# EAGLE design training_board (EAGLE 9.6.2)
AUTHOR: Varun Madabushi; REVISION: 0.1; SCH_DESC: Arduino Motor Shield for 2019-20 Training; TEAM: Electrical Training
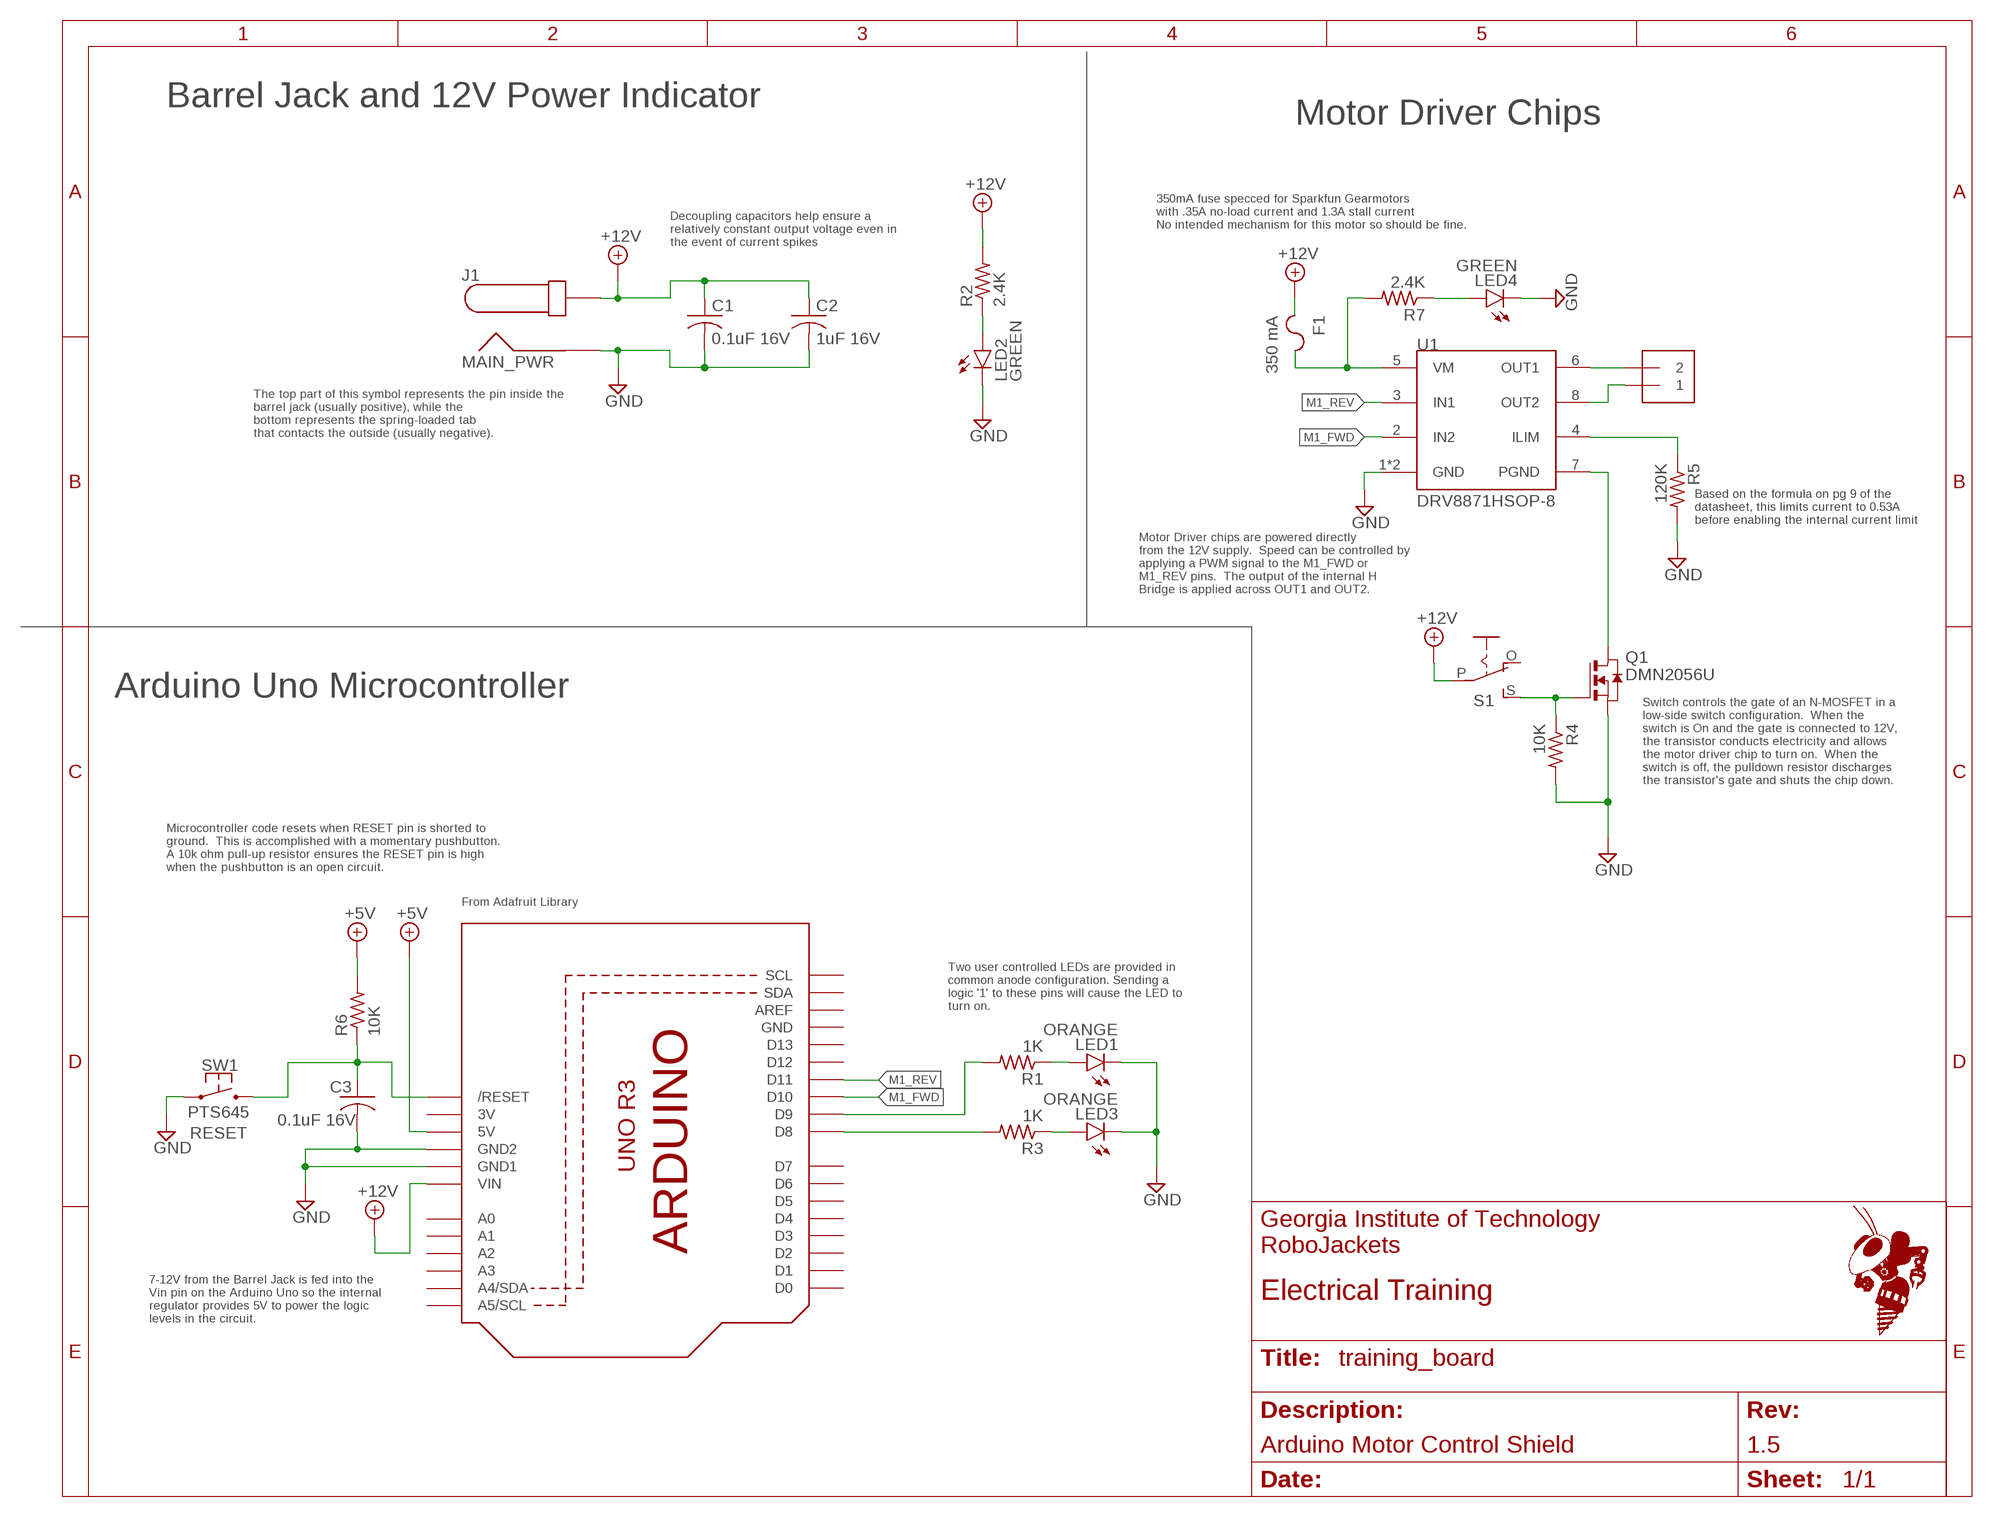
[diagram p0: schematic, sheet 1]
FRAME1 (FRAME_A_L): AUTHOR: Varun Madabushi; REVISION: 1.5; SCH_DESC: Arduino Motor Control Shield; TEAM: Electrical Training

## Parts
C1  0.1uF 16V  C-USC0805  [C0805]
C2  1uF 16V  C-USC0805  [C0805]
C3  0.1uF 16V  C-USC0805  [C0805]
F1  350 mA  CHIP_FUSE1812  [F1812]
J1  MAIN_PWR  PJ-037A  [PJ-037A]
LED1  ORANGE  LEDCHIP-LED0603  [CHIP-LED0603]
LED2  GREEN  LEDCHIP-LED0603  [CHIP-LED0603]
LED3  ORANGE  LEDCHIP-LED0603  [CHIP-LED0603]
LED4  GREEN  LEDCHIP-LED0603  [CHIP-LED0603]
OUT  1X2-3.5MM  [1X2-3.5MM]
Q1  DMN2056U  NMOSSOT-23-3  [SOT-23-3]
Q2  ARDUINOR3-NOIOREF-NOTEXT  [ARDUINOR3-NOTEXT-NOIOREF]
R1  1K  R-US_R0603  [R0603]
R2  2.4K  R-US_R0603  [R0603]
R3  1K  R-US_R0603  [R0603]
R4  10K  R-US_R0603  [R0603]
R5  120K  R-US_R0603  [R0603]
R6  10K  R-US_R0603  [R0603]
R7  2.4K  R-US_R0603  [R0603]
S1  EG1903-ND  EG1218S  [EG1218]
SW1  PTS645  [PTS645]
U1  DRV8871HSOP-8  [HSOP-8]

## Nets
+5V: Q2.5V R6.2
+12V: C1.1 C2.1 F1.1 J1.P$2 Q2.VIN R2.2 S1.P
GND: C1.2 C2.2 C3.2 J1.P$1 LED1.C LED2.C LED3.C LED4.C Q1.2(S) Q2.GND1 Q2.GND2 R4.2 R5.2 SW1.1 SW1.2 U1.1(GND) U1.9(GND)
M1_FWD: Q2.D10 U1.2(IN2)
M1_REV: Q2.D11 U1.3(IN1)
N$1: F1.2 R7.2 U1.5(VM)
N$2: OUT.2 U1.6(OUT1)
N$3: Q1.3(D) U1.7(PGND)
N$4: OUT.1 U1.8(OUT2)
N$5: Q1.1(G) R4.1 S1.S
N$6: R5.1 U1.4(ILIM)
N$8: LED4.A R7.1
N$10: Q2.D9 R1.2
N$11: Q2.D8 R3.2
N$14: LED1.A R1.1
N$15: LED3.A R3.1
N$16: LED2.A R2.1
RESET: C3.1 Q2.RESET(/RESET) R6.1 SW1.3 SW1.4
Unconnected: Q2.A0 Q2.A1 Q2.A2 Q2.A3 Q2.A4(A4/SDA) Q2.A5(A5/SCL) Q2.AREF Q2.D0 Q2.D1 Q2.D2 Q2.D3 Q2.D4 Q2.D5 Q2.D6 Q2.D7 Q2.D12 Q2.D13 Q2.SCL Q2.SDA S1.O

## Notes on the sheet
- Barrel Jack and 12V Power Indicator
- Motor Driver Chips
- 350mA fuse specced for Sparkfun Gearmotors
  with .35A no-load current and 1.3A stall current
  No intended mechanism for this motor so should be fine.
- Decoupling capacitors help ensure a
  relatively constant output voltage even in
  the event of current spikes
- The top part of this symbol represents the pin inside the 
  barrel jack (usually positive), while the
  bottom represents the spring-loaded tab
  that contacts the outside (usually negative).
- Based on the formula on pg 9 of the 
  datasheet, this limits current to 0.53A
  before enabling the internal current limit
- Motor Driver chips are powered directly
  from the 12V supply.  Speed can be controlled by
  applying a PWM signal to the M1_FWD or
  M1_REV pins.  The output of the internal H
  Bridge is applied across OUT1 and OUT2.
- Arduino Uno Microcontroller
- Switch controls the gate of an N-MOSFET in a
  low-side switch configuration.  When the
  switch is On and the gate is connected to 12V,
  the transistor conducts electricity and allows
  the motor driver chip to turn on.  When the
  switch is off, the pulldown resistor discharges
  the transistor's gate and shuts the chip down.
- Microcontroller code resets when RESET pin is shorted to
  ground.  This is accomplished with a momentary pushbutton. 
  A 10k ohm pull-up resistor ensures the RESET pin is high
  when the pushbutton is an open circuit.
- From Adafruit Library
- Two user controlled LEDs are provided in 
  common anode configuration. Sending a 
  logic '1' to these pins will cause the LED to
  turn on.
- 7-12V from the Barrel Jack is fed into the
  Vin pin on the Arduino Uno so the internal
  regulator provides 5V to power the logic 
  levels in the circuit.

## Power pins joined to a net without a drawn wire
3V: Q2.3V
GND: Q2.GND

## Library data of the parts
C1-C3 = rcl:C-US: CAPACITOR, American symbol; SPICEPREFIX: C
F1 = RoboJackets-Fuses:CHIP_FUSE
J1 = RoboJackets-Connectors:PJ-037A
LED1-LED4 = led:LED: LED OSRAM: - CHIPLED LG R971, LG N971, LY N971, LG Q971, LY Q971, LO R971, LY R971 LH N974, LH R974 LS Q976, LO Q976, LY Q976 LO Q996 - Hyper CHIPLED LW Q18S LB Q993, LB Q99A, LB R99A - SideLED LS A670, LO A670, LY A670, LG A670, LP A670 LB A673, LV A673, LT A673, LW A673 LH A674 LY A675 LS A676, LA A676, LO A676, LY A676, LW A676 LS A679, LY A679, LG A679 - Hyper Micro SIDELED® LS Y876, LA Y876, LO Y876, LY Y876 LT Y87S - SmartLED LW L88C, LW L88S LB L89C, LB L89S, LG L890 LS L89K, LO L89K, LY L89K LS L896, LA L896, LO L896, LY L896 - TOPLED LS T670, LO T670, LY T670, LG T670, LP T670 LSG T670, LSP T670, LSY T670, LOP T670, LYG T670 LG T671, LOG T671, LSG T671 LB T673, LV T673, LT T673, LW T673 LH T674 LS T676, LA T676, LO T676, LY T676, LB T676, LH T676, LSB T676, LW T676 LB T67C, LV T67C, LT T67C, LS T67K, LO T67K, LY T67K, LW E67C LS E67B, LA E67B, LO E67B, LY E67B, LB E67C, LV E67C, LT E67C LW T67C LS T679, LY T679, LG T679 LS T770, LO T770, LY T770, LG T770, LP T770 LB T773, LV T773, LT T773, LW T773 LH T774 LS E675, LA E675, LY E675, LS T675 LS T776, LA T776, LO T776, LY T776, LB T776 LHGB T686 LT T68C, LB T68C - Hyper Mini TOPLED® LB M676 - Mini TOPLED Santana® LG M470 LS M47K, LO M47K, LY M47K Source: http://www.osram.convergy.de LUXEON: - LUMILED® LXK2-PW12-R00, LXK2-PW12-S00, LXK2-PW14-U00, LXK2-PW14-V00 LXK2-PM12-R00, LXK2-PM12-S00, LXK2-PM14-U00 LXK2-PE12-Q00, LXK2-PE12-R00, LXK2-PE12-S00, LXK2-PE14-T00, LXK2-PE14-U00 LXK2-PB12-K00, LXK2-PB12-L00, LXK2-PB12-M00, LXK2-PB14-N00, LXK2-PB14-P00, LXK2-PB14-Q00 LXK2-PR12-L00, LXK2-PR12-M00, LXK2-PR14-Q00, LXK2-PR14-R00 LXK2-PD12-Q00, LXK2-PD12-R00, LXK2-PD12-S00 LXK2-PH12-R00, LXK2-PH12-S00 LXK2-PL12-P00, LXK2-PL12-Q00, LXK2-PL12-R00 Source: www.luxeon.com KINGBRIGHT: KA-3528ASYC Source: www.kingbright.com
OUT = adafruit:1X2: 3.5mm Terminal block http://www.ladyada.net/library/pcb/eaglelibrary.html
Q1 = RoboJackets-Discrete:NMOS
Q2 = adafruit:ARDUINOR3-NOIOREF
R1-R7 = rcl:R-US_: RESISTOR, American symbol; SPICEPREFIX: R
S1 = adafruit:EG1218: SLIDING SWITCH 0.1" spacing through hole, vertical SPDT slide switch http://www.ladyada.net/library/pcb/eaglelibrary.html
SW1 = RoboJackets-Switches:PTS645; FUNCTION: RESET
U1 = RoboJackets-ICs:DRV8871: 3.6-A Brushed DC Motor Driver With Internal Current Sense and PWM Control; DKPN: 296-43024-1-ND

## Board
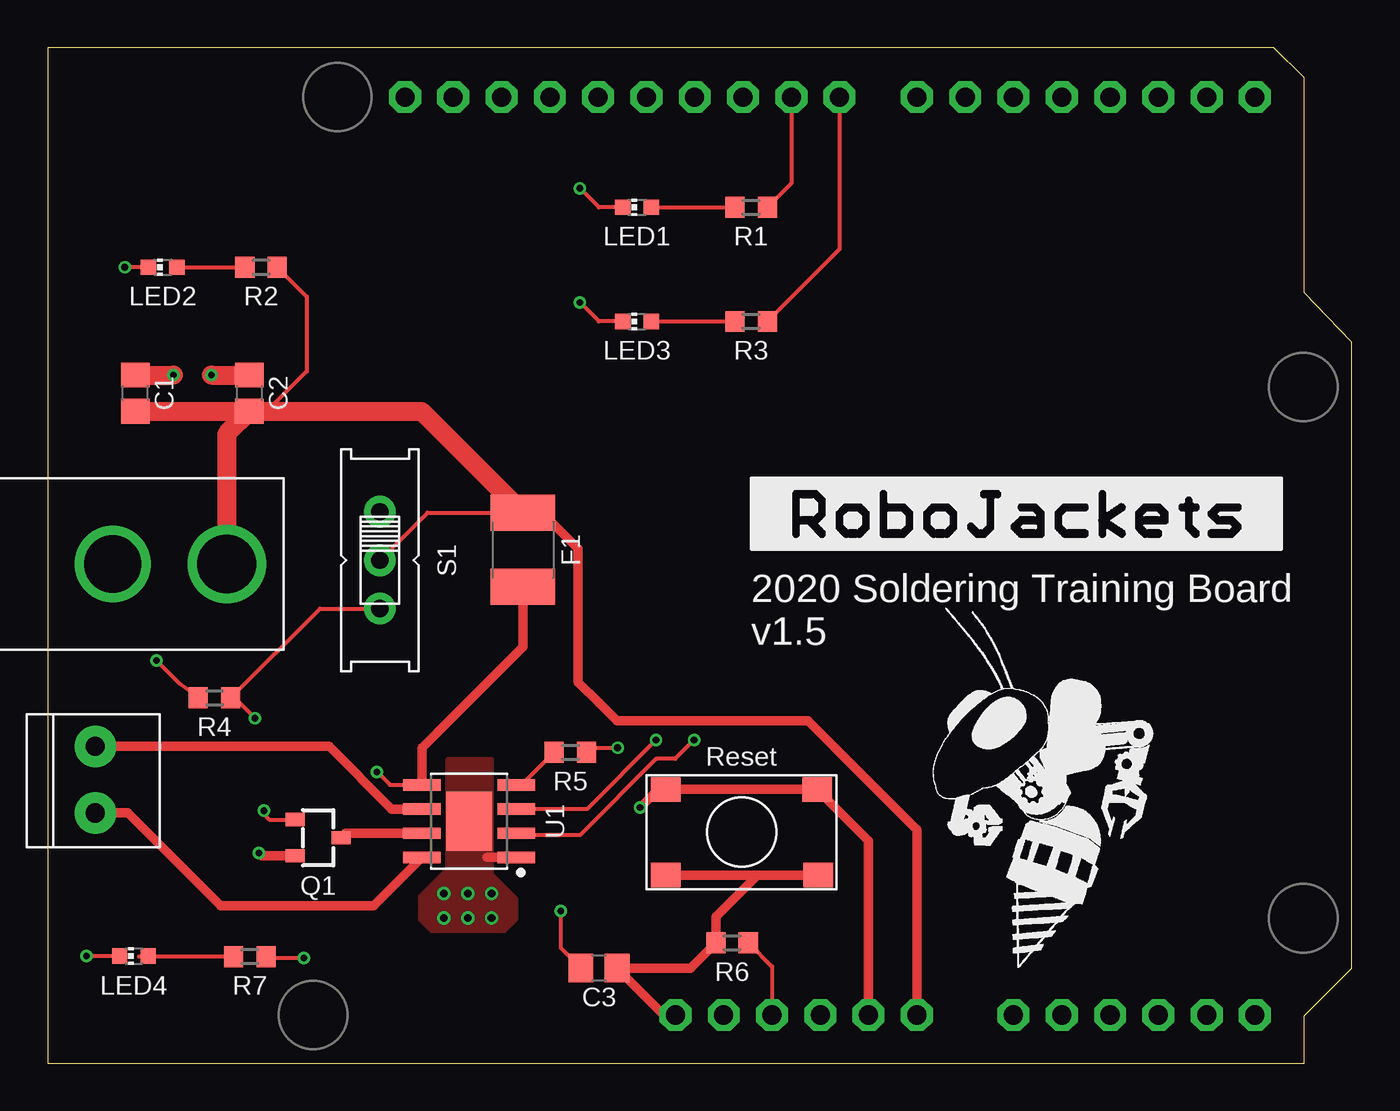
[diagram p1: board, top side]
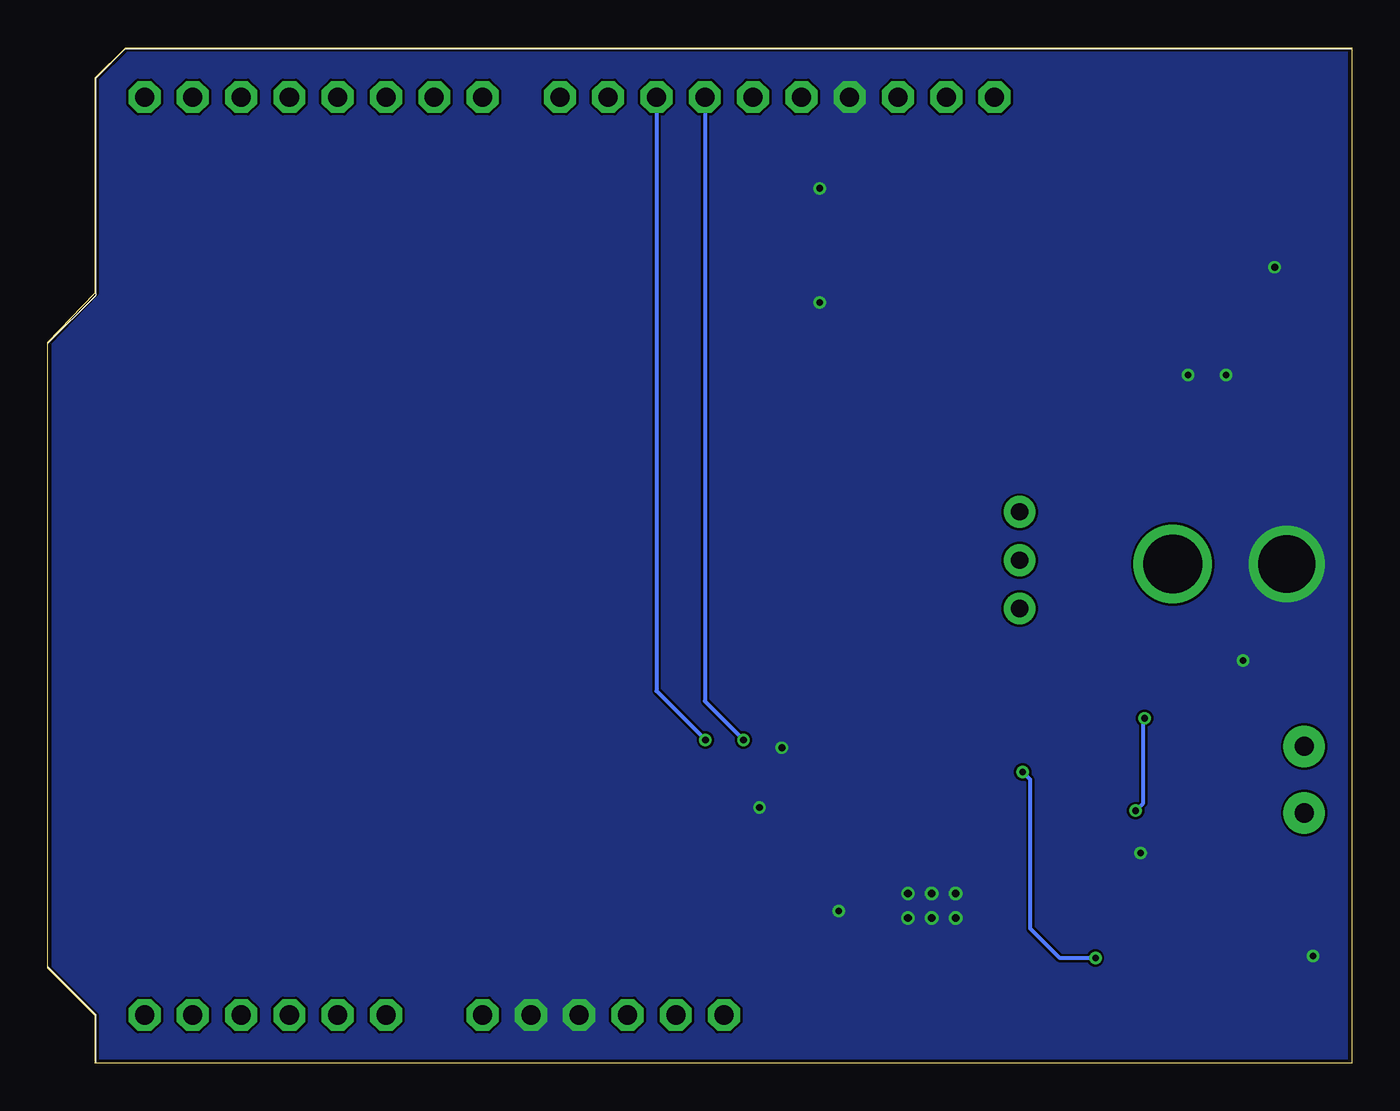
[diagram p2: board, bottom side, seen from below]

Size 68.6 x 53.4 mm. Coordinates in mm from the lower left corner, seen from the top.
Outline: 0,0 66.1,0 66.1,2.5 68.6,5 68.6,37.9 66.1,40.5 66.1,51.8 64.5,53.4 0,53.4 0,0
Copper layers (1+16): Top 0.035mm / dielectric 1.53mm / Bottom 0.035mm
Design rules "JLCPCB (2 Layer)": minimum track width 5mil, minimum drill 0.3mm, track to track 5mil, track to pad 5mil, pad to pad 5mil, via to via 20mil, smd to smd 5mil, copper to edge 0.2mm, drill to drill 21mil, minimum pad ring 6mil, minimum via ring 6mil, stop-mask expansion 6mil, vias tented up to drill 30mil, thermal gap 10mil

### Footprints (pad centres in the part's own frame; a part is rotated, then mirrored left to right if it is on the bottom)
C0805 = smd 1.3 x 1.5: 1 -0.95,0; 2 0.95,0
F1812 = smd 1.9 x 3.4: 1 -1.95,0; 2 1.95,0
PJ-037A = drill 3: P$1 0,0 | drill 3.1: P$2 6,0
CHIP-LED0603 = smd 0.8 x 0.8: A 0,-0.75; C 0,0.75
1X2-3.5MM = drill 1 pad 2.184: 1 1.8,0; 2 -1.7,0
SOT-23-3 = smd 0.7 x 1: 1 -0.95,-1.2; 2 0.95,-1.2; 3 0,1.2
ARDUINOR3-NOTEXT-NOIOREF = drill 1 pad 1.676 octagon: 3V 35.56,2.54; 5V 38.1,2.54; A0 50.8,2.54; A1 53.34,2.54; A2 55.88,2.54; A3 58.42,2.54; A4 60.96,2.54; A5 63.5,2.54; AREF 23.876,50.8; D0 63.5,50.8; D1 60.96,50.8; D2 58.42,50.8; D3 55.88,50.8; D4 53.34,50.8; D5 50.8,50.8; D6 48.26,50.8; D7 45.72,50.8; D8 41.656,50.8; D9 39.116,50.8; D10 36.576,50.8; D11 34.036,50.8; D12 31.496,50.8; D13 28.956,50.8; GND 26.416,50.8; GND1 43.18,2.54; GND2 40.64,2.54; RESET 33.02,2.54; SCL 18.796,50.8; SDA 21.336,50.8; VIN 45.72,2.54
R0603 = smd 1 x 1.1: 1 -0.85,0; 2 0.85,0
EG1218 = drill 0.9 pad 1.676: O -2.54,0; P 0,0; S 2.54,0
PTS645 = smd 1.55 x 1.3: 1 -3.975,2.25; 2 3.975,2.25; 3 -3.975,-2.25; 4 4.025,-2.25
HSOP-8 = smd 1.968 x 0.599: 1 -2.473,1.905; 2 -2.473,0.635; 3 -2.473,-0.635; 4 -2.473,-1.905; 5 2.473,-1.905; 6 2.473,-0.635; 7 2.473,0.635; 8 2.473,1.905 | smd 2.4 x 3.1: 9 0,0

### Placement (x,y rotation side)
C1  4.62,35.23 90 top
C2  10.62,35.23 90 top
C3  29,5 180 top
F1  25,27 270 top
J1  3.43,26.25 0 top
LED1  31,45 90 top
LED2  6.06,41.85 90 top
LED3  31,39 90 top
LED4  4.54,5.64 90 top
OUT  2.51,14.96 270 top
Q1  14.23,11.86 270 top
Q2  0,0 0 top
R1  37,45 0 top
R2  11.23,41.85 0 top
R3  37,39 0 top
R4  8.78,19.21 180 top
R5  27.5,16.35 0 top
R6  36,6.33 0 top
R7  10.64,5.61 0 top
S1  17.48,26.45 270 top
SW1  36.5,12.15 0 top
U1  22.17,12.73 180 top
U$1  [ROBOJACKETS]  37,27 0 top
U$2  [ROBOBUZZ_1.0X]  51,5 0 top

### Tracks (layer width: path | path; a pad name or v marks a point on that pad's centre or on a via)
+5V
  Top 0.2: R6.2 38.1,5.08 Q2.5V
+12V
  Top 0.2: S1.P 19.98,28.95 F1.1 | C2.1 11.53,34.28 13.63,36.38 13.63,40.3 R2.2
  Top 0.5: Q2.VIN 45.72,12.28 40,18 29.95,18 29,18.95 27.91,20.04 27.91,27.04 26,28.95 F1.1
  Top 1: C1.1 C2.1 | C2.1 9.43,33.09 J1.P$2 | C2.1 19.67,34.28 F1.1
GND  (via drill 0.35, 0.4)
  Top 0.2: LED4.C v2.04,5.64 | LED2.C v4.06,41.85 | LED1.C 29,45 v28,46 | LED3.C 29,39 v28,40 | C3.2 27,6.05 v27,8 | R4.2 6.94,19.96 v5.72,21.18 | R5.2 28.59,16.59 v29.98,16.59
  Top 0.5: Q1.2 11.25,10.91 v11.11,11.05 | U1.1 23.11,10.82 | Q2.GND1 43.18,11.7 SW1.2 SW1.1 32.12,14.4 v31.16,13.44
  Top 1: C1.2 v6.62,36.18 | v8.62,36.18 C2.2
  other vias: 20.85,8.93 22.1,8.93 23.35,8.93 23.35,7.63 22.1,7.63 20.85,7.63
  pour Bottom (no thermals): 0,0 66.1,0 66.1,2.6 68.6,5.1 68.6,37.9 66.1,40.4 66.1,51.9 64.51,53.4 0,53.4
  pour Top (no thermals): 23.34,16 23.34,9.97 24.63,8.68 24.63,7.55 24.01,6.93 20.21,6.93 19.59,7.55 19.59,8.78 21.04,10.23 21.04,16
M1_FWD  (via drill 0.35)
  Top 0.2: v34,17 33,16 32,16 28,12 24.74,12 U1.2
  Bottom 0.2: v34,17 36.58,19.58 Q2.D10
M1_REV  (via drill 0.35)
  Top 0.2: v32,17 28.36,13.37 U1.3
  Bottom 0.2: v32,17 34.04,19.04 Q2.D11
N$1  (via drill 0.35)
  Top 0.2: v13.49,5.53 11.57,5.53 R7.2 | v17.32,15.32 18.01,14.63 U1.5
  Top 0.5: U1.5 19.7,16.59 25,21.89 F1.2
  Bottom 0.2: v13.49,5.53 15.36,5.53 16.91,7.08 16.91,14.91 v17.32,15.32
N$2
  Top 0.5: U1.6 18.11,13.37 14.81,16.66 OUT.2
N$3
  Top 0.5: U1.7 15.66,12.1 Q1.3
N$4
  Top 0.5: OUT.1 4.22,13.16 9.1,8.28 17.15,8.28 U1.8
N$5  (via drill 0.35)
  Top 0.2: v11.38,13.28 11.38,13.09 11.66,12.81 Q1.1 | S1.S 14.33,23.91 R4.1 9.84,19.21 v10.91,18.14
  Bottom 0.2: v11.38,13.28 10.98,13.68 10.98,18.14 v10.91,18.14
N$6
  Top 0.2: R5.1 24.93,14.63 U1.4
N$8
  Top 0.2: R7.1 4.82,5.61 LED4.A
N$10
  Top 0.2: Q2.D9 39.12,46.27 R1.2
N$11
  Top 0.2: Q2.D8 41.66,42.81 R3.2
N$14
  Top 0.2: LED1.A R1.1
N$15
  Top 0.2: LED3.A R3.1
N$16
  Top 0.2: LED2.A R2.1
RESET
  Top 0.5: 37.34,9.9 SW1.3 | Q2.RESET 32.41,2.54 C3.1 33.82,5 R6.1 35.15,7.71 37.34,9.9 | SW1.4 37.34,9.9

### Text on the board
tPlace: 2020 Soldering Training Board
tNames: Reset
tValues: POWER | FUSE OK
tDocu: OFF | ON